# EAGLE board uRinks_v4.0 (EAGLE 9.3.1)
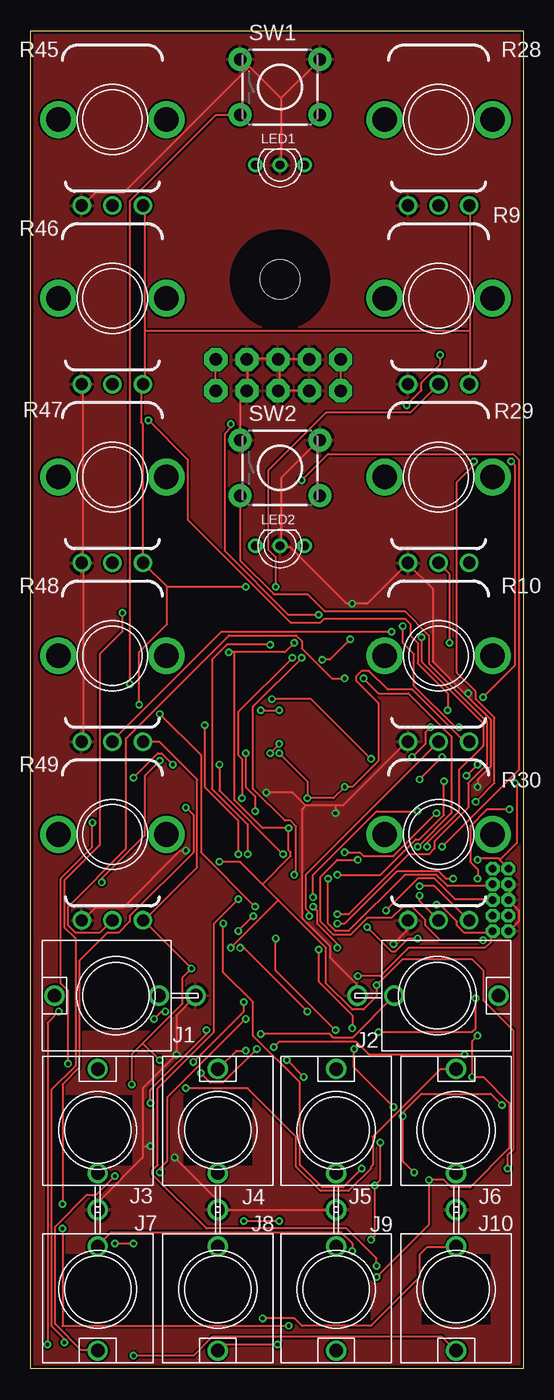
[diagram p5: board, top side]
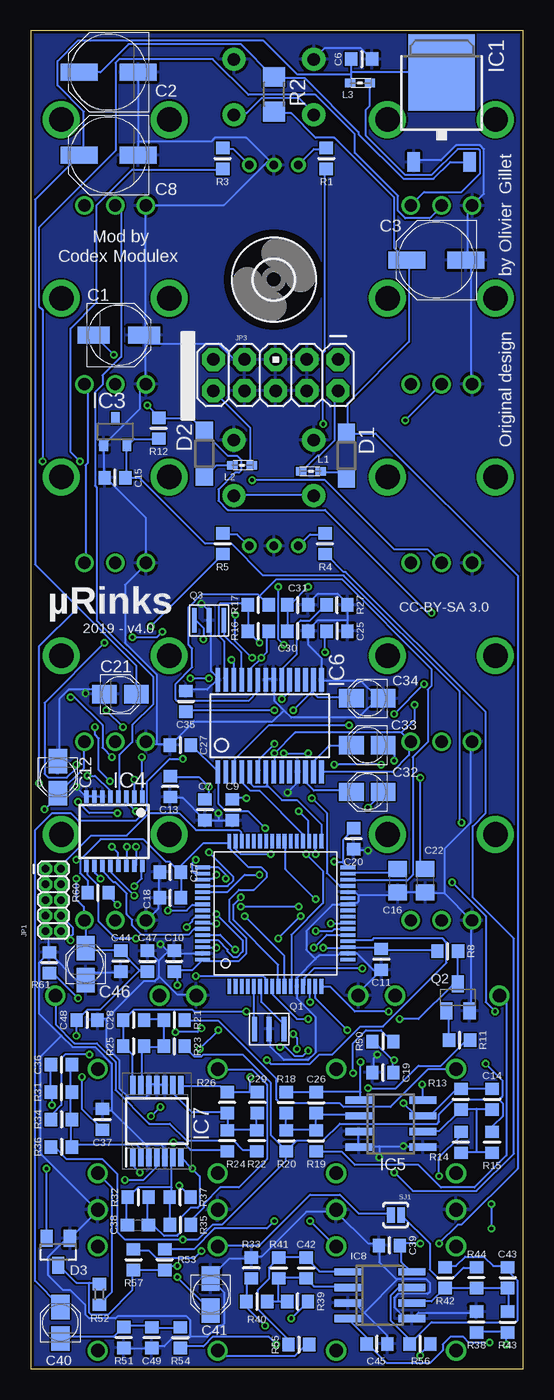
[diagram p6: board, bottom side, seen from below]

Size 40.14 x 109 mm. Coordinates in mm from the lower left corner, seen from the top.
Outline: 40.14,0 0,0 0,109 40.14,109 40.14,0
Copper layers (1*16): Top 0.035mm / dielectric 1.5mm / Bottom 0.035mm
Design rules "dirt_cheap_dirty_boards.v1.1": minimum track width 6mil, minimum drill 12mil, track to track 6mil, track to pad 6mil, pad to pad 6mil, via to via 6mil, smd to smd 0mil, copper to edge 10mil, drill to drill 10mil, minimum pad ring 10mil, minimum via ring 6mil, stop-mask expansion 2mil, vias tented up to drill 25mil, thermal gap 10mil

## Footprints (pad centres in the part's own frame; a part is rotated, then mirrored left to right if it is on the bottom)
PANASONIC_C = smd 2.6 x 1.4: + 2.05,0; - -2.05,0
PANASONIC_D = smd 3 x 1.4: + 2.4,0; - -2.4,0
PARTS_AMAN_RESISTOR_0603 = smd 1 x 1.1: 1 -0.85,0; 2 0.85,0
PANASONIC_A = smd 2 x 1.5: + 1.3,0; - -1.3,0
C0805 = smd 1.3 x 1.5: 1 -0.95,0; 2 0.95,0
C0603 = smd 1.1 x 1: 1 -0.85,0; 2 0.85,0
SOD123 = smd 1.4 x 1.4: A 1.9,0; C -1.9,0
SOT23 = smd 1 x 1.4: 1 -0.95,-1.1; 2 0.95,-1.1; 3 0,1.1
3,2 = hole 3.2: 0,0
TO252 = smd 1 x 1.6: 1 -2.28,-4.8; 2 2.28,-4.8 | smd 5.4 x 6.2: 3 0,2.5
TQFP-10X10-64 = smd 1.2 x 0.3: 1 -5.936,3.75; 2 -5.936,3.25; 3 -5.936,2.75; 4 -5.936,2.25; 5 -5.936,1.75; 6 -5.936,1.25; 7 -5.936,0.75; 8 -5.936,0.25; 9 -5.936,-0.25; 10 -5.936,-0.75; 11 -5.936,-1.25; 12 -5.936,-1.75; 13 -5.936,-2.25; 14 -5.936,-2.75; 15 -5.936,-3.25; 16 -5.936,-3.75; 33 5.886,-3.75; 34 5.886,-3.25; 35 5.886,-2.75; 36 5.886,-2.25; 37 5.886,-1.75; 38 5.886,-1.25; 39 5.886,-0.75; 40 5.886,-0.25; 41 5.886,0.25; 42 5.886,0.75; 43 5.886,1.25; 44 5.886,1.75; 45 5.886,2.25; 46 5.886,2.75; 47 5.886,3.25; 48 5.886,3.75 | smd 0.3 x 1.2: 17 -3.75,-5.911; 18 -3.25,-5.911; 19 -2.75,-5.911; 20 -2.25,-5.911; 21 -1.75,-5.911; 22 -1.25,-5.911; 23 -0.75,-5.911; 24 -0.25,-5.911; 25 0.25,-5.911; 26 0.75,-5.911; 27 1.25,-5.911; 28 1.75,-5.911; 29 2.25,-5.911; 30 2.75,-5.911; 31 3.25,-5.911; 32 3.75,-5.911; 49 3.75,5.936; 50 3.25,5.936; 51 2.75,5.936; 52 2.25,5.936; 53 1.75,5.936; 54 1.25,5.936; 55 0.75,5.936; 56 0.25,5.936; 57 -0.25,5.936; 58 -0.75,5.936; 59 -1.25,5.936; 60 -1.75,5.936; 61 -2.25,5.936; 62 -2.75,5.936; 63 -3.25,5.936; 64 -3.75,5.936
DBZ_R-PDSO-G3 = smd 0.7 x 1: 1 -0.95,-1.1; 2 0.95,-1.1; 3 0,1.1
TSSOP16 = smd 0.35 x 1: 1 -1.95,-2.825; 2 -1.3,-2.825; 3 -0.65,-2.825; 4 0,-2.825; 5 0.65,-2.825; 6 1.3,-2.825; 7 1.95,-2.825; 8 2.6,-2.825; 9 2.6,2.825; 10 1.95,2.825; 11 1.3,2.825; 12 0.65,2.825; 13 0,2.825; 14 -0.65,2.825; 15 -1.3,2.825; 16 -1.95,2.825
SO08 = smd 0.6 x 2.2: 1 -1.905,-2.6; 2 -0.635,-2.6; 3 0.635,-2.6; 4 1.905,-2.6; 5 1.905,2.6; 6 0.635,2.6; 7 -0.635,2.6; 8 -1.905,2.6
SSOP28 = smd 0.381 x 1.905: 1 -4.55,-3.752; 2 -3.9,-3.752; 3 -3.25,-3.752; 4 -2.6,-3.752; 5 -1.95,-3.752; 6 -1.3,-3.752; 7 -0.65,-3.752; 8 0,-3.752; 9 0.65,-3.752; 10 1.3,-3.752; 11 1.95,-3.752; 12 2.6,-3.752; 13 3.25,-3.752; 14 3.9,-3.752; 15 3.9,3.752; 16 3.25,3.752; 17 2.6,3.752; 18 1.95,3.752; 19 1.3,3.752; 20 0.65,3.752; 21 0,3.752; 22 -0.65,3.752; 23 -1.3,3.752; 24 -1.95,3.752; 25 -2.6,3.752; 26 -3.25,3.752; 27 -3.9,3.752; 28 -4.55,3.752
SOP65P640X120-14N = smd 1.475 x 0.45: 1 -2.938,1.95; 2 -2.938,1.3; 3 -2.938,0.65; 4 -2.938,0; 5 -2.938,-0.65; 6 -2.938,-1.3; 7 -2.938,-1.95; 8 2.938,-1.95; 9 2.938,-1.3; 10 2.938,-0.65; 11 2.938,0; 12 2.938,0.65; 13 2.938,1.3; 14 2.938,1.95
WQP-PJ301M-12_JACK = drill 1.1: P$1 0,5; P$2 0,-3.5; P$3 0,-6.5
2X5-1.27 = drill 0.61 pad 1.067 octagon: 1 -1.27,3.81; 2 0,3.81; 3 -1.27,2.54; 4 0,2.54; 5 -1.27,1.27; 6 0,1.27; 7 -1.27,0; 8 0,0; 9 -1.27,-1.27; 10 0,-1.27
AVR_ICSP = drill 1.016 pad 1.88 octagon: 1 -1.27,5.08; 2 1.27,5.08; 3 -1.27,2.54; 4 1.27,2.54; 5 -1.27,0; 6 1.27,0; 7 -1.27,-2.54; 8 1.27,-2.54; 9 -1.27,-5.08; 10 1.27,-5.08
0603 = smd 0.85 x 0.7: 1 -0.9,0; 2 0.7,0
LED-BICOLOR-THROUGHHOLE = drill 0.7: 1 -2,0; 2 0,0; 3 2,0
INSTRUO_CRYSTAL_SMALLER = smd 0.4 x 2: GND 0,0; X1 -1.2,0; X2 1.2,0
SOT23-BEC = smd 1 x 1.4: B -0.95,-1.1; C 0,1.1; E 0.95,-1.1
R1206 = smd 1.6 x 1.803: 1 -1.422,0; 2 1.422,0
INSTRUO_Q-POT2 = drill 1 pad 1.5: P$1 -2.5,-7; P$2 0,-7; P$3 2.5,-7 | drill 2 pad 2.5: P$4 -4.4,0; P$5 4.4,0
R0603 = smd 1 x 1.1: 1 -0.85,0; 2 0.85,0
SJ_2S-NOTRACE = smd 0.635 x 1.27: 1 -0.45,0; 2 0.4,0
TACTILE-PTH = drill 1.016 pad 1.88: 1 -3.251,2.261; 2 3.251,2.261; 3 -3.251,-2.261; 4 3.251,-2.261

## Placement (x,y rotation side)
C1  22u  [PANASONIC_C]  32.95,84.21 0 bottom
C2  47u  [PANASONIC_D]  33.79,105.61 180 bottom
C3  47u  [PANASONIC_D]  7.08,90.31 180 bottom
C6  100n  [PARTS_AMAN_RESISTOR_0603]  13.16,106.68 0 bottom
C7  1u  [PARTS_AMAN_RESISTOR_0603]  25.94,45.53 270 bottom
C8  47u  [PANASONIC_D]  33.79,98.86 180 bottom
C9  100n  [PARTS_AMAN_RESISTOR_0603]  23.7,45.53 270 bottom
C10  100n  [PARTS_AMAN_RESISTOR_0603]  28.44,33.2 90 bottom
C11  100n  [PARTS_AMAN_RESISTOR_0603]  11.57,33.35 270 bottom
C12  10u  [PANASONIC_A]  37.93,48.2 270 bottom
C13  100n  [PARTS_AMAN_RESISTOR_0603]  28.77,47.43 270 bottom
C14  2.2n  [PARTS_AMAN_RESISTOR_0603]  2.54,21.96 90 bottom
C15  100n  [PARTS_AMAN_RESISTOR_0603]  33.26,72.59 180 bottom
C16  2.2u  [C0805]  10.23,39.77 270 bottom
C17  100n  [PARTS_AMAN_RESISTOR_0603]  28.76,40.46 180 bottom
C18  1u  [PARTS_AMAN_RESISTOR_0603]  28.76,38.36 180 bottom
C19  100n  [PARTS_AMAN_RESISTOR_0603]  11.43,24.13 180 bottom
C20  100n  [PARTS_AMAN_RESISTOR_0603]  13.83,43.18 270 bottom
C21  10u  [PANASONIC_A]  32.84,54.95 0 bottom
C22  2.2u  [C0805]  7.99,39.77 270 bottom
C25  100n  [PARTS_AMAN_RESISTOR_0603]  15.17,60.09 0 bottom
C26  10n  [PARTS_AMAN_RESISTOR_0603]  16.87,21.68 90 bottom
C27  100n  [PARTS_AMAN_RESISTOR_0603]  27.94,50.8 180 bottom
C28  10n  [PARTS_AMAN_RESISTOR_0603]  31.75,28.41 0 bottom
C29  2.2n  [PARTS_AMAN_RESISTOR_0603]  21.68,21.69 270 bottom
C30  1u  [PARTS_AMAN_RESISTOR_0603]  18.38,60.09 0 bottom
C31  100n  [PARTS_AMAN_RESISTOR_0603]  18.38,62.23 0 bottom
C32  10u  [PANASONIC_A]  12.7,46.99 180 bottom
C33  10u  [PANASONIC_A]  12.7,50.8 180 bottom
C34  10u  [PANASONIC_A]  12.7,54.61 180 bottom
C35  100n  [PARTS_AMAN_RESISTOR_0603]  27.49,54.37 90 bottom
C36  10n  [PARTS_AMAN_RESISTOR_0603]  37.63,24.77 180 bottom
C37  100n  [PARTS_AMAN_RESISTOR_0603]  34.29,20.32 90 bottom
C38  10n  [C0603]  31.39,11.7 0 bottom
C39  100n  [PARTS_AMAN_RESISTOR_0603]  10.9,10.06 180 bottom
C40  10u  [PANASONIC_A]  37.71,3.75 90 bottom
C41  10u  [PANASONIC_A]  25.48,6.06 270 bottom
C42  18p  [PARTS_AMAN_RESISTOR_0603]  17.68,8.22 90 bottom
C43  18p  [PARTS_AMAN_RESISTOR_0603]  1.27,7.42 90 bottom
C44  100n  [PARTS_AMAN_RESISTOR_0603]  32.8,33.2 270 bottom
C45  100n  [PARTS_AMAN_RESISTOR_0603]  11.91,2.03 180 bottom
C46  10u  [PANASONIC_A]  35.66,32.95 90 bottom
C47  100n  [PARTS_AMAN_RESISTOR_0603]  30.62,33.2 90 bottom
C48  100n  [PARTS_AMAN_RESISTOR_0603]  35.54,28.41 0 bottom
C49  220p  [PARTS_AMAN_RESISTOR_0603]  30.28,2.54 270 bottom
D1  1N5819HW  [SOD123]  14.41,74.38 270 bottom
D2  1N5819HW  [SOD123]  25.99,74.54 90 bottom
D3  BAT54S  [SOT23]  37.89,9.53 180 bottom
H1  MOUNT-HOLE3.2  [3,2]  20.32,88.73 0 bottom
IC1  LM1117-3.3  [TO252]  6.64,103.1 0 bottom
IC2  STM32F405RGT6  [TQFP-10X10-64]  20.2,37.08 90 bottom
IC3  LM4040B10  [DBZ_R-PDSO-G3]  33.24,76.34 0 bottom
IC4  4051PW  [TSSOP16]  32.99,43.78 180 bottom
IC5  MCP6002  [SO08]  10.79,19.97 270 bottom
IC6  WM8731  [SSOP28]  20.34,52.37 0 bottom
IC7  MCP6004-I_ST  [SOP65P640X120-14N]  29.85,20.17 90 bottom
IC8  TL072  [SO08]  11.69,6 270 bottom
J1  WQP-PJ301M-12_JACK  [WQP-PJ301M-12_JACK]  6.94,30.4 90 top
J2  WQP-PJ301M-12_JACK  [WQP-PJ301M-12_JACK]  33.14,30.4 270 top
J3  WQP-PJ301M-12_JACK  [WQP-PJ301M-12_JACK]  5.47,19.43 0 top
J4  WQP-PJ301M-12_JACK  [WQP-PJ301M-12_JACK]  15.25,19.43 0 top
J5  WQP-PJ301M-12_JACK  [WQP-PJ301M-12_JACK]  24.9,19.43 0 top
J6  WQP-PJ301M-12_JACK  [WQP-PJ301M-12_JACK]  34.68,19.43 0 top
J7  WQP-PJ301M-12_JACK  [WQP-PJ301M-12_JACK]  5.47,6.48 180 top
J8  WQP-PJ301M-12_JACK  [WQP-PJ301M-12_JACK]  15.25,6.48 180 top
J9  WQP-PJ301M-12_JACK  [WQP-PJ301M-12_JACK]  24.9,6.48 180 top
J10  WQP-PJ301M-12_JACK  [WQP-PJ301M-12_JACK]  34.68,6.48 180 top
JP1  M05X2MINIJTAG  [2X5-1.27]  37.66,36.92 0 bottom
JP3  M05X2PTH  [AVR_ICSP]  20.17,80.94 270 bottom
L1  [0603]  17.39,73.11 180 bottom
L2  [0603]  22.81,73.61 0 bottom
L3  [0603]  13.19,104.74 0 bottom
LED1  WP115VEGW  [LED-BICOLOR-THROUGHHOLE]  20.32,98.06 180 top
LED2  WP115VEGW  [LED-BICOLOR-THROUGHHOLE]  20.32,67.04 180 top
Q1  8MHz  [INSTRUO_CRYSTAL_SMALLER]  20.7,27.67 180 bottom
Q2  MMBT3904  [SOT23-BEC]  5.32,30.26 0 bottom
Q3  12.288MHz  [INSTRUO_CRYSTAL_SMALLER]  25.6,60.96 180 bottom
R1  180  [PARTS_AMAN_RESISTOR_0603]  16.04,98.59 90 bottom
R2  4.7  [R1206]  20.3,103.82 270 bottom
R3  180  [PARTS_AMAN_RESISTOR_0603]  24.5,98.59 90 bottom
R4  180  [PARTS_AMAN_RESISTOR_0603]  16.14,67.21 90 bottom
R5  180  [PARTS_AMAN_RESISTOR_0603]  24.5,67.21 90 bottom
R8  10k  [PARTS_AMAN_RESISTOR_0603]  6.15,34.01 180 bottom
R9  10kB  [INSTRUO_Q-POT2]  33.25,87.2 0 top
R10  10kB  [INSTRUO_Q-POT2]  33.25,58.09 0 top
R11  100k  [PARTS_AMAN_RESISTOR_0603]  5.18,26.77 180 bottom
R12  2.2k  [PARTS_AMAN_RESISTOR_0603]  29.71,76.62 90 bottom
R13  47k  [PARTS_AMAN_RESISTOR_0603]  5.08,21.96 90 bottom
R14  100k  [PARTS_AMAN_RESISTOR_0603]  5.08,18.45 270 bottom
R15  180k  [PARTS_AMAN_RESISTOR_0603]  2.54,18.45 270 bottom
R16  2.2k  [PARTS_AMAN_RESISTOR_0603]  21.59,60.09 180 bottom
R17  2.2k  [PARTS_AMAN_RESISTOR_0603]  21.59,62.23 180 bottom
R18  20k  [PARTS_AMAN_RESISTOR_0603]  19.32,21.69 90 bottom
R19  100k  [PARTS_AMAN_RESISTOR_0603]  16.88,18.57 90 bottom
R20  120k  [PARTS_AMAN_RESISTOR_0603]  19.3,18.57 90 bottom
R21  100k  [PARTS_AMAN_RESISTOR_0603]  28.44,28.41 0 bottom
R22  100k  [PARTS_AMAN_RESISTOR_0603]  21.71,18.57 270 bottom
R23  120k  [PARTS_AMAN_RESISTOR_0603]  28.44,26.27 0 bottom
R24  120k  [PARTS_AMAN_RESISTOR_0603]  24.13,18.57 270 bottom
R25  20k  [PARTS_AMAN_RESISTOR_0603]  31.75,26.27 0 bottom
R26  20k  [PARTS_AMAN_RESISTOR_0603]  24.13,21.69 270 bottom
R27  36k  [PARTS_AMAN_RESISTOR_0603]  15.17,62.23 180 bottom
R28  10kB  [INSTRUO_Q-POT2]  33.25,101.76 0 top
R29  10kB  [INSTRUO_Q-POT2]  33.25,72.64 0 top
R30  10kB  [INSTRUO_Q-POT2]  33.25,43.53 0 top
R31  20k  [PARTS_AMAN_RESISTOR_0603]  37.63,22.54 180 bottom
R32  20k  [PARTS_AMAN_RESISTOR_0603]  31.38,13.97 0 bottom
R33  47k  [PARTS_AMAN_RESISTOR_0603]  22.16,8.22 270 bottom
R34  100k  [PARTS_AMAN_RESISTOR_0603]  37.63,20.31 0 bottom
R35  100k  [PARTS_AMAN_RESISTOR_0603]  27.94,11.73 180 bottom
R36  120k  [PARTS_AMAN_RESISTOR_0603]  37.63,18.08 0 bottom
R37  120k  [PARTS_AMAN_RESISTOR_0603]  27.96,13.98 180 bottom
R38  47k  [PARTS_AMAN_RESISTOR_0603]  3.81,3.81 270 bottom
R39  47k  [PARTS_AMAN_RESISTOR_0603]  18.39,5.48 180 bottom
R40  6.8k  [PARTS_AMAN_RESISTOR_0603]  21.71,5.48 0 bottom
R41  47k  [PARTS_AMAN_RESISTOR_0603]  19.92,8.22 90 bottom
R42  47k  [PARTS_AMAN_RESISTOR_0603]  6.35,7.42 90 bottom
R43  6.8k  [PARTS_AMAN_RESISTOR_0603]  1.27,3.81 90 bottom
R44  47k  [PARTS_AMAN_RESISTOR_0603]  3.81,7.42 270 bottom
R45  10kB  [INSTRUO_Q-POT2]  6.66,101.76 0 top
R46  10kB  [INSTRUO_Q-POT2]  6.66,87.2 0 top
R47  10kB  [INSTRUO_Q-POT2]  6.66,72.64 0 top
R48  10kB  [INSTRUO_Q-POT2]  6.66,58.09 0 top
R49  10kB  [INSTRUO_Q-POT2]  6.66,43.53 0 top
R50  3.3M  [PARTS_AMAN_RESISTOR_0603]  11.43,26.67 0 bottom
R51  6.8k  [PARTS_AMAN_RESISTOR_0603]  32.55,2.55 90 bottom
R52  100k  [R0603]  34.53,6.06 270 bottom
R53  1M  [PARTS_AMAN_RESISTOR_0603]  29.21,8.89 90 bottom
R54  36k  [PARTS_AMAN_RESISTOR_0603]  27.94,2.54 90 bottom
R55  1k  [PARTS_AMAN_RESISTOR_0603]  18.28,1.97 0 bottom
R56  1k  [PARTS_AMAN_RESISTOR_0603]  8.41,2.03 0 bottom
R57  470k  [PARTS_AMAN_RESISTOR_0603]  31.75,8.89 90 bottom
R60  10k  [PARTS_AMAN_RESISTOR_0603]  34.64,38.78 180 bottom
R61  10k  [PARTS_AMAN_RESISTOR_0603]  38.62,33.07 270 bottom
SJ1  SOLDERJUMPERNC2  [SJ_2S-NOTRACE]  10.39,12.54 180 bottom
SW1  [TACTILE-PTH]  20.32,104.41 0 top
SW2  [TACTILE-PTH]  20.32,73.39 0 top

## Tracks (layer width: path | path; a pad name or v marks a point on that pad's centre or on a via)
+3V3  (via drill 0.3)
  Top 0.152: 38.25,41.45 38.1,41.6 36.58,41.6 v36.42,41.45 | 38.25,41.45 38.86,40.84 JP1.1 | 16.61,58.37 20.73,58.37 v21.49,59.13 | 16.61,58.37 v16.15,58.37 | v38.86,16.31 38.86,17.37 39.32,17.83 39.32,27.58 36.88,30.02 36.88,32.46 35.97,33.38 30.33,33.38 v28.19,31.24 28.19,30.33 27.13,29.26 26.21,29.26 24.08,31.39 24.08,34.29 20.12,38.25 | v15.39,41.3 17.07,41.3 18.9,39.47 | 20.12,38.25 18.9,39.47 | 18.9,39.47 21.18,41.76 21.18,42.06 21.03,42.22 v21.03,44.04 18.9,44.04 16.61,46.33 16.61,58.37 | v16.31,34.29 20.12,38.1 20.12,38.25 | 38.25,41.45 39.62,42.82 39.62,47.55 v39.47,47.7
  Bottom 0.152: C18.1 27.89,38.41 27.89,40.39 C17.1 | 36.12,41.45 36.12,40.39 35.51,39.78 35.51,38.86 R60.2 | 36.12,41.45 34.44,43.13 30.94,43.13 29.11,41.3 28.8,41.3 28.19,40.69 | 28.19,40.69 28.04,40.54 C17.1 | 28.19,40.69 26.06,42.82 24.08,42.82 IC2.48 23.93,42.82 23.93,42.37 22.4,40.84 21.34,40.84 20.88,40.39 20.88,40.08 21.95,39.01 23.16,39.01 23.93,38.25 23.93,36.42 22.55,35.05 22.55,33.83 23.16,33.22 26.06,33.22 IC2.64 26.21,33.22 26.98,32.46 28.19,32.46 | 28.19,40.69 C17.1 | 36.12,41.45 v36.42,41.45 | v16.15,58.37 16.15,60.05 C25.1 | v21.49,59.13 22.4,60.05 R16.2 22.4,60.2 22.4,62.18 R17.2 22.55,62.33 24.69,62.33 24.84,62.18 24.84,59.74 24.38,59.28 24.38,56.24 IC6.27 | R8.2 7.01,34.14 11.43,34.14 C11.1 11.58,34.29 14.17,34.29 IC2.19 14.33,34.29 v16.31,34.29 | C27.1 26.98,50.75 24.99,48.77 IC6.1 24.84,48.62 24.84,46.02 24.23,45.41 22.4,45.41 v21.03,44.04 | 14.63,41.3 14.63,41.15 14.33,40.84 IC2.32 | 14.63,41.3 14.63,43.13 13.87,43.89 C20.1 | 28.19,32.46 28.35,32.46 C10.1 28.19,32.46 | v38.86,16.31 38.86,10.67 D3.2 | 28.19,32.46 v28.19,31.24 | v15.39,41.3 14.63,41.3 | 14.02,105.61 14.02,106.68 C6.1 | 14.02,105.61 14.02,105.46 | 14.02,105.46 14.02,104.85 L3.1 | 14.02,105.61 6.71,105.61 IC1.3 | 36.27,62.03 39.78,65.53 39.78,95.25 36.27,98.75 C8.+ 36.12,98.91 35.81,99.21 35.81,102.41 37.95,104.55 37.95,106.53 36.27,108.2 21.18,108.2 18.44,105.46 14.02,105.46 | 36.27,62.03 31.55,57.3 31.55,55.02 C21.+ | v39.47,47.7 39.47,58.83 36.27,62.03
+3V3_A  (via drill 0.3)
  Top 0.152: 35.81,84.58 35.81,80.31 R9.P$3 | 35.81,84.58 35.81,94.64 R28.P$3 | 11.12,63.7 v17.53,63.7 | 11.12,63.7 9.3,65.53 R47.P$3 9.14,65.68 9.14,76.96 8.99,77.11 8.99,80.01 9.14,80.16 R46.P$3 9.3,80.31 9.3,84.58 | 9.3,84.58 9.3,94.64 R45.P$3 | 9.3,84.58 35.81,84.58 | v31.7,39.32 32.92,39.32 35.66,36.58 R30.P$3 | v36.42,27.13 35.97,26.67 v35.97,23.77 36.88,23.77 39.01,21.64 39.01,17.98 35.81,14.78 34.29,14.78 33.68,15.39 v32.46,15.39 32.46,11.73 v28.19,7.47 | R10.P$3 35.66,51.21 35.2,51.21 31.09,55.32 29.11,55.32 27.58,56.84 26.98,56.84 26.52,56.39 26.52,56.08 28.35,54.25 28.35,49.53 26.21,47.4 v25.6,47.4 24.69,46.48 v22.55,46.48 22.55,47.85 v20.27,50.14 | v8.23,23.16 8.23,25.6 9.14,26.52 | 9.14,26.52 12.34,29.72 12.34,31.85 v13.11,32.61 9.3,36.42 R49.P$3 9.3,36.58 13.56,40.84 13.56,48.01 10.52,51.05 9.3,51.05 R48.P$3 | 9.14,26.52 v10.52,25.15 | v36.42,39.93 36.42,40.69 35.81,41.3 35.81,44.2 37.19,45.57 v39.01,45.57 | 11.12,63.7 11.12,60.66 8.84,58.37 v8.84,54.1
  Bottom 0.152: R29.P$3 35.66,65.68 35.66,73.61 35.51,73.76 35.51,80.01 35.66,80.16 R9.P$3 | C30.1 19.2,60.2 19.2,62.18 C31.1 19.2,62.33 18.9,62.33 v17.53,63.7 | L3.2 12.5,104.7 12.5,102.87 12.8,102.56 12.8,100.43 9.6,97.23 7.47,97.23 5.33,99.36 3.66,99.36 3.5,99.21 3.5,97.38 5.03,95.86 8.08,95.86 9.14,94.79 R45.P$3 | 31.24,32.46 30.63,32.46 C47.1 | 31.24,32.46 32.77,33.98 C44.1 32.92,34.14 35.51,34.14 C46.+ 35.66,34.29 35.66,36.42 R30.P$3 35.81,36.58 35.81,37.64 36.42,38.25 v36.42,39.93 | v31.7,39.32 31.09,39.93 31.09,40.84 IC4.16 | v35.97,23.77 35.97,21.18 34.29,19.51 C37.1 | v36.42,27.13 36.42,28.35 C48.1 36.27,28.5 35.51,29.26 34.44,29.26 31.24,32.46 | v32.46,15.39 30.94,15.39 29.87,16.46 29.87,17.22 IC7.4 | v28.19,7.47 25.6,4.88 C41.+ | v22.55,46.48 23.62,46.48 C9.1 | C7.1 25.91,46.48 25.6,46.79 v25.6,47.4 26.36,48.16 28.65,48.16 C13.1 | R10.P$3 35.81,51.05 35.81,48.92 37.8,46.94 C12.+ 37.8,46.79 v39.01,45.57 | IC6.14 16.31,48.62 10.67,48.62 9.3,49.99 9.3,51.05 R48.P$3 9.3,51.21 9.91,51.82 | 9.91,51.82 18.59,51.82 v20.27,50.14 20.27,48.77 IC6.8 | 10.67,25.15 10.67,24.23 C19.1 | 10.67,25.15 12.19,26.67 R50.1 | v13.11,32.61 17.07,32.61 17.83,31.85 17.83,31.24 IC2.13 | v8.23,23.16 8.23,21.95 IC5.8 | v10.52,25.15 10.67,25.15 | v8.84,54.1 8.84,52.88 9.91,51.82
AREF_-10  (via drill 0.3)
  Top 0.152: v28.5,18.44 28.5,15.39 v28.04,14.94 28.04,10.82 v27.74,10.52 | v5.03,44.5 5.03,42.52 2.44,39.93 2.44,31.39 3.05,30.79 v3.05,24.84
  Bottom 0.152: v28.5,18.44 27.74,18.44 27.13,17.83 24.23,17.83 R24.2 | v28.04,14.94 27.13,14.02 R37.1 | R12.1 29.72,75.74 31.7,75.74 32.16,75.29 IC3.2 32.31,75.13 32.31,72.69 C15.1 32.31,72.54 31.24,72.54 25.91,67.21 23.77,67.21 21.18,64.62 14.63,64.62 5.18,55.17 5.18,44.65 v5.03,44.5 | R20.1 19.36,17.83 20.57,19.05 20.57,23.32 22.86,25.6 26.06,25.6 26.21,25.45 26.82,25.45 27.58,26.21 R23.2 | 1.98,21.95 1.68,21.64 1.68,20.57 2.44,19.81 2.44,19.36 R15.1 | 1.98,21.95 5.64,21.95 6.86,20.73 6.86,20.12 7.01,19.96 14.94,19.96 16.31,18.59 18.44,18.59 19.2,17.83 R20.1 | R36.1 38.41,17.98 38.1,17.98 37.19,17.07 34.29,17.07 33.07,15.85 33.07,11.12 32.46,10.52 v27.74,10.52 26.52,10.52 25.3,11.73 24.54,11.73 19.36,16.92 19.36,17.68 R20.1 | v3.05,24.84 1.68,23.47 1.68,22.25 1.98,21.95
AUX_OUT
  Bottom 0.152: IC6.13 17.07,48.77 17.07,49.53 15.85,50.75 14.02,50.75 C33.+
BOOT_FLASH  (via drill 0.3)
  Top 0.152: v36.27,30.18 36.27,27.74 35.97,27.43 v28.35,27.43 | v26.21,27.74 26.21,28.8 23.47,31.55 v23.47,34.14
  Bottom 0.152: v36.27,30.18 38.25,32.16 38.56,32.16 R61.2 | v28.35,27.43 26.52,27.43 v26.21,27.74 | v23.47,34.14 24.69,35.36 26.06,35.36 IC2.60
BRIGHTNESS_ATT  (via drill 0.3)
  Top 0.152: v33.53,49.84 v31.7,48.01 | v36.88,54.71 39.47,57.3 39.47,73.61 v39.17,73.91
  Bottom 0.152: v31.7,48.01 31.7,46.63 IC4.2 | v33.53,49.84 34.29,50.6 34.29,52.43 36.58,54.71 v36.88,54.71 | v39.17,73.91 39.17,86.26 39.47,86.56 39.47,92.96 33.22,99.21 33.22,106.38 32.92,106.68 25.3,106.68 22.4,103.78 16.92,103.78 13.72,100.58 13.72,99.06 10.21,95.56 10.21,94.34 9.6,93.73 7.62,93.73 6.71,94.64 R45.P$2
BRIGHTNESS_CV  (via drill 0.3)
  Top 0.152: v17.37,29.87 17.37,29.11 v13.26,24.99
  Bottom 0.152: R18.2 19.2,22.55 16.92,22.55 C26.2 16.76,22.55 13.26,22.55 | v17.37,29.87 17.37,31.09 IC2.14 | 13.26,22.55 13.26,21.95 IC5.1 | 13.26,22.55 v13.26,24.99
BRIGHTNESS_POT
  Bottom 0.152: IC4.4 32.92,46.63 32.92,49.99 31.85,51.05 31.85,52.43 30.18,54.1 30.18,56.39 34.75,60.96 34.75,71.78 34.9,71.93 34.9,79.55 34.29,80.16 34.29,80.92 32.77,82.45 32.77,94.18 33.22,94.64 R28.P$2
CV_NORMALIZATION  (via drill 0.3)
  Top 0.152: v26.21,9.6 26.21,10.21 25.3,11.12 6.55,11.12 5.49,10.06 J7.P$2
  Bottom 0.152: v26.21,9.6 26.82,8.99 29.87,8.99 30.48,9.6 31.7,9.6 R57.2
DAMP_ATT  (via drill 0.3)
  Top 0.152: v33.53,42.52 39.78,48.77 39.78,74.07 39.32,74.52 24.23,74.52 v22.1,72.39
  Bottom 0.152: v33.53,42.52 33.07,42.06 33.07,41 IC4.13 | v22.1,72.39 16.15,72.39 10.52,66.75 7.77,66.75 6.71,65.68 R47.P$2
DAMP_CV  (via drill 0.3)
  Top 0.152: v17.07,34.29 17.37,34.29 v22.55,29.11
  Bottom 0.152: v17.07,34.29 16,35.36 14.33,35.36 IC2.21 | v22.55,29.11 26.82,29.11 26.98,29.26 31.7,29.26 32.46,28.5 C28.1 32.61,28.35 32.61,26.36 R25.1 32.46,26.21 31.85,25.6 31.85,23.16 IC7.14
DAMP_POT  (via drill 0.3)
  Top 0.152: v36.42,49.23 v35.51,48.31 | v34.14,59.13 34.14,64.77 33.38,65.53 R29.P$2
  Bottom 0.152: v35.51,48.31 34.9,48.31 33.68,47.09 33.68,46.63 IC4.5 | v36.42,49.23 36.42,48.92 37.19,48.16 38.71,48.16 39.01,48.46 39.01,54.25 v34.14,59.13
FM_CV  (via drill 0.3)
  Top 0.152: v22.25,23.77 v20.88,25.15
  Bottom 0.152: 22.25,22.55 24.08,22.55 R26.1 24.23,22.55 24.69,23.01 27.89,23.01 IC7.8 | 22.25,22.55 21.79,22.55 C29.1 | v20.88,25.15 20.57,24.84 17.37,24.84 16.61,25.6 15.54,25.6 13.26,27.89 11.43,27.89 6.25,33.07 6.25,34.75 6.55,35.05 12.19,35.05 12.34,34.9 14.17,34.9 IC2.20 | 22.25,22.55 v22.25,23.77
FREQUENCY_ATT  (via drill 0.3)
  Top 0.152: v31.09,49.84 32.16,50.9 32.16,51.82 v32.61,52.27 | v33.98,53.65 33.98,55.02 31.55,57.45 31.55,59.13 30.94,59.74 30.94,60.66 30.48,61.11 23.93,61.11 23.62,60.81 21.18,60.81 12.8,69.19 12.8,74.07 v9.6,77.27
  Bottom 0.152: v31.09,49.84 31.09,46.63 IC4.1 | v33.98,53.65 v32.61,52.27 | v9.6,77.27 6.71,80.16 R46.P$2
FREQUENCY_POT  (via drill 0.3)
  Top 0.152: v17.68,41.91 17.68,44.35 14.78,47.24 14.78,57.76 16,58.98 v19.51,58.98 | v19.96,63.7 19.96,66.14 19.36,66.75 19.36,73.15 24.08,77.88 30.94,77.88 33.22,80.16 R9.P$2
  Bottom 0.152: v17.68,41.91 16.31,40.54 16.31,37.95 18.9,35.36 18.9,31.24 IC2.11 | v19.51,58.98 19.96,59.44 v19.96,63.7
GEOMETRY_ATT  (via drill 0.3)
  Top 0.152: v32.31,42.52 32.31,42.82 34.9,45.41 34.9,48.77 36.88,50.75 36.88,52.58 31.85,57.61 v31.85,59.59 | v29.41,60.05 15.54,60.05 6.71,51.21 R48.P$2
  Bottom 0.152: v32.31,42.52 32.31,41 IC4.14 | v31.85,59.59 29.87,59.59 v29.41,60.05
GEOMETRY_CV  (via drill 0.3)
  Top 0.152: v18.14,36.88 v16.92,35.66 | v19.96,35.05 19.96,32.46 v24.84,27.58 | v26.36,26.06 26.36,24.54 v29.57,21.34 | v31.24,16 30.33,16.92 v30.33,20.57 30.33,20.88 31.85,22.4 37.49,22.4 v38.41,21.49
  Bottom 0.152: C36.2 38.56,24.69 38.56,22.55 R31.2 38.41,22.4 v38.41,21.49 | v16.92,35.66 15.54,35.66 15.39,35.81 14.33,35.81 IC2.22 | v19.96,35.05 v18.14,36.88 | v26.36,26.06 v24.84,27.58 | v30.33,20.57 v29.57,21.34 | v31.24,16 31.7,16.46 31.7,17.22 IC7.1
GEOMETRY_POT  (via drill 0.3)
  Top 0.152: v22.71,36.88 22.71,37.19 22.4,37.49 22.4,40.23 33.22,51.05 R10.P$2
  Bottom 0.152: v22.71,36.88 19.51,33.68 19.51,31.24 IC2.10
GND  (via drill 0.3)
  Top 0.152: v29.57,34.59 30.63,35.66 30.63,36.42 R30.P$1 | v19.2,46.94 21.34,46.94 22.4,45.87 | 24.84,45.87 25.45,45.87 30.63,51.05 R10.P$1 | 24.84,45.87 22.4,45.87 | 24.84,45.87 v24.84,45.26 | 22.4,45.87 22.1,45.57 22.1,36.73 24.38,34.44 24.38,33.53 26.52,31.39 26.52,30.48 J2.P$3 | SW2.2 23.47,75.59 20.42,72.54 20.42,67.06 LED2.2 20.42,66.9 21.18,66.9 25.76,62.33 v26.21,62.33 27.43,62.33 30.63,65.53 R29.P$1 30.79,65.53 32.77,63.55 32.77,57.61 35.51,54.86 | v36.42,47.4 36.42,48.01 37.49,49.07 37.49,52.88 35.51,54.86 | 35.51,54.86 v35.66,55.02 | 20.42,103.48 20.42,98.15 LED1.2 | 20.42,103.48 23.47,106.53 SW1.2 | 20.42,103.48 17.83,106.07 | 17.83,106.07 17.37,106.53 17.07,106.53 SW1.1 | SW2.1 17.07,79.1 17.53,79.55 JP3.4 17.68,79.7 17.68,82.14 JP3.3 17.68,82.3 20.12,82.3 JP3.5 | 20.27,79.7 20.27,82.14 JP3.5 | 20.27,79.7 22.71,79.7 JP3.8 | 20.27,79.7 JP3.6 | JP3.7 22.71,82.3 20.27,82.3 JP3.5 | JP1.3 39.01,39.32 39.01,38.25 JP1.5 39.01,38.1 39.78,37.34 39.78,36.42 39.01,35.66 JP1.9 | J6.P$3 34.75,12.95 J10.P$3 | 24.84,12.95 J9.P$3 | J4.P$3 15.24,12.95 J8.P$3 | 24.84,12.95 15.39,12.95 J4.P$3 | 24.84,12.95 J5.P$3 | J7.P$3 5.49,12.95 J3.P$3 5.49,13.11 5.49,13.56 9.14,17.22 9.14,18.14 | J1.P$3 13.41,30.33 11.89,28.8 v11.89,25.6 9.14,22.86 9.14,18.14 | 9.14,18.14 v9.75,18.14 | R48.P$1 4.27,51.21 4.27,65.53 R47.P$1 4.27,65.68 4.27,80.16 R46.P$1 | v12.65,42.22 12.19,42.22 7.62,37.64 5.33,37.64 4.27,36.58 R49.P$1 | v11.73,17.22 15.24,13.72 15.24,13.11 J4.P$3 | 17.83,106.07 7.62,95.86 5.33,95.86 4.27,94.79 R45.P$1
  Bottom 0.152: C17.2 29.72,40.39 29.72,38.41 C18.2 29.72,38.25 29.72,37.49 30.63,36.58 R30.P$1 | IC7.10 29.26,23.16 29.72,23.16 IC7.11 29.87,23.16 30.48,23.16 IC7.12 30.63,23.01 30.63,22.25 30.79,22.1 32.16,22.1 32.92,22.86 32.92,25.15 33.98,26.21 33.98,28.5 | 33.98,28.5 34.59,28.5 C48.2 | 33.98,28.5 30.94,31.55 30.02,31.55 29.72,31.85 29.72,32 | 29.72,33.22 29.72,32 | 29.72,33.22 30.48,33.98 C47.2 | 28.96,33.98 28.5,33.98 C10.2 | 29.72,33.22 28.96,33.98 | IC2.63 26.21,33.83 28.19,33.83 28.35,33.98 C10.2 | 29.72,32 28.19,30.48 26.67,30.48 J2.P$3 | 28.96,33.98 v29.57,34.59 | 28.96,33.98 C10.2 | IC6.22 20.88,56.24 20.42,56.24 IC6.21 20.27,56.08 20.27,54.41 19.51,53.65 | 14.33,60.96 14.33,62.18 R27.1 14.33,62.33 15.09,63.09 16.76,63.09 17.53,62.33 C31.2 | 14.33,60.96 14.33,60.2 C25.2 | 14.33,60.96 16.76,60.96 17.53,60.2 C30.2 17.53,60.05 17.53,58.98 16.46,57.91 16.46,56.24 IC6.15 16.31,56.08 13.26,56.08 11.89,54.71 11.73,54.71 | 11.73,54.71 11.43,54.71 C34.- 11.73,54.71 | 19.51,53.65 18.9,53.03 13.41,53.03 11.73,54.71 | 24.84,44.65 25.91,44.65 C7.2 26.06,44.81 27.74,46.48 28.65,46.48 C13.2 | 24.84,44.65 23.77,44.65 C9.2 | 29.87,50.9 30.48,50.9 30.63,51.05 R10.P$1 | 29.87,50.9 28.8,50.9 C27.2 28.65,50.9 26.82,52.73 20.42,52.73 19.51,53.65 | v19.2,46.94 18.44,47.7 18.44,48.62 IC6.11 | v24.84,45.26 24.84,44.65 | 35.66,55.32 34.59,55.32 34.29,55.02 C21.- | 35.66,55.32 37.03,55.32 37.8,54.56 37.8,49.53 C12.- | C35.2 27.43,55.32 25.76,55.32 24.99,56.08 IC6.28 24.84,56.24 25.45,56.84 25.45,60.96 Q3.GND 25.6,61.72 v26.21,62.33 | IC4.6 34.29,46.63 34.9,46.63 IC4.7 35.05,46.63 35.51,46.63 IC4.8 35.66,46.63 v36.42,47.4
  Bottom 0.152: v35.66,55.02 35.66,55.32 | 31.39,99.97 31.39,105.46 C2.- | 31.39,99.97 31.39,98.91 C8.- | C6.2 12.34,106.68 13.26,107.59 16.15,107.59 SW1.1 | 31.39,99.97 25.45,99.97 25.15,100.28 22.55,100.28 20.73,98.45 | 20.73,98.45 20.42,98.15 LED1.2 20.73,98.45 | 30.79,83.52 30.79,80.31 R9.P$1 30.79,80.16 31.24,79.7 31.24,78.18 34.14,75.29 IC3.1 34.14,75.13 34.14,72.69 C15.2 33.98,72.54 30.79,69.34 30.79,65.68 R29.P$1 30.79,65.53 32.46,63.86 32.46,59.13 29.87,56.54 29.87,50.9 | 30.79,83.52 30.79,84.12 C1.+ | C1.+ 30.79,84.28 30.79,94.64 R28.P$1 30.63,94.79 24.38,94.79 20.73,98.45 | 30.79,83.52 24.84,83.52 23.62,82.3 22.86,82.3 JP3.7 | 30.79,83.52 C1.+ | 33.53,21.03 34.29,21.03 C37.2 | 30.79,18.29 30.63,18.14 30.63,17.37 IC7.3 | 30.79,18.29 33.53,21.03 | 30.79,18.29 29.57,18.29 29.26,17.98 29.26,17.37 IC7.5 | C44.2 32.92,32.31 34.9,32.31 35.51,31.7 C46.- 35.66,31.7 36.42,31.7 38.56,33.83 R61.1 | R61.1 38.71,33.98 38.71,35.36 38.86,35.51 JP1.9 | 33.53,21.03 33.53,24.84 34.9,26.21 36.73,26.21 37.64,27.13 | 37.64,27.13 39.47,28.96 39.47,33.07 38.71,33.83 R61.1 | J10.P$3 34.75,12.8 36.88,10.67 D3.1 37.03,10.52 37.34,10.52 38.71,9.14 38.71,7.62 37.49,6.4 36.88,6.4 35.66,5.18 35.66,4.42 35.36,4.12 33.22,4.12 33.07,4.27 27.43,4.27 27.13,3.96 27.13,2.59 | R51.1 32.46,1.68 30.33,1.68 C49.2 30.18,1.83 29.26,1.83 28.5,2.59 27.13,2.59 | 27.13,2.59 25.76,2.59 24.84,3.5 24.54,3.5 24.38,3.66 24.38,6.25 25.45,7.32 C41.- 25.45,7.47 23.93,8.99 22.25,8.99 R33.1 22.1,9.14 21.34,9.14 17.68,12.8 15.39,12.8 J4.P$3 | 12.95,4.57 13.72,5.33 14.17,5.33 IC8.3 | 12.95,4.57 11.12,2.74 11.12,2.13 C45.1
  Bottom 0.152: R38.1 3.81,4.57 8.53,4.57 8.99,4.12 IC8.5 9.14,4.12 9.6,4.12 10.52,5.03 10.52,5.79 10.21,6.1 7.77,6.1 7.62,6.25 7.62,7.01 7.92,7.32 10.21,7.32 | J8.P$3 15.24,12.8 12.65,10.21 11.89,10.21 C39.2 11.73,10.06 11.73,8.69 10.36,7.32 10.21,7.32 | 10.21,7.32 12.95,4.57 | 37.64,27.13 39.32,25.45 39.32,17.53 34.75,12.95 J6.P$3 | 11.73,18.14 13.26,18.14 IC5.4 13.41,18.14 13.41,19.2 IC5.3 | 11.73,18.14 v9.75,18.14 8.23,18.14 IC5.5 | 11.89,32.16 13.56,30.48 J1.P$3 | 11.89,32.16 11.58,32.46 C11.2 11.89,32.16 | v11.89,25.6 12.19,25.3 12.19,24.23 C19.2 | 11.89,32.16 13.56,33.83 14.17,33.83 IC2.18 14.33,33.83 14.94,33.83 15.09,33.68 16.61,33.68 16.92,33.38 | 16.92,33.38 18.44,31.85 18.44,31.24 IC2.12 18.44,31.09 18.44,30.18 16.92,28.65 16.92,25.76 17.53,25.15 19.51,25.15 20.57,26.21 20.57,27.58 Q1.GND | IC1.1 8.84,98.45 6.71,98.45 5.49,99.67 3.5,99.67 3.2,99.36 3.2,95.71 4.12,94.79 R45.P$1 4.27,94.64 4.57,94.34 4.57,90.37 C3.- 4.57,90.22 4.27,89.92 4.27,80.31 R46.P$1 | 13.41,38.56 13.41,38.1 13.56,37.95 14.17,37.95 IC2.26 14.33,37.8 15.54,37.8 17.68,35.66 17.68,34.14 16.92,33.38 | 13.41,38.56 13.72,38.86 14.17,38.86 IC2.28 | 13.41,38.56 10.52,38.56 10.36,38.71 C16.2 10.21,38.86 8.08,38.86 C22.2 7.92,38.71 6.4,38.71 | v12.65,42.22 13.72,42.22 C20.2 | Q2.E 4.27,29.26 4.27,36.42 R49.P$1 4.27,36.58 6.4,38.71 | 6.4,38.71 6.4,42.37 4.27,44.5 4.27,51.05 R48.P$1 | 11.73,18.14 v11.73,17.22
  pour Top (isolate 0.012): 0,109.02 40.14,109.02 40.14,0 0,0
  pour Bottom (isolate 0.012): 0,109.02 40.14,109.02 40.14,0 0,0
I2C_SCL  (via drill 0.3)
  Top 0.152: v17.22,46.48 17.22,49.68 16.92,49.99 16.92,53.49 v21.34,57.91
  Bottom 0.152: R16.1 20.88,60.05 20.88,58.37 v21.34,57.91 22.25,57 22.25,56.24 IC6.24 | v17.22,46.48 16,45.26 16,40.39 14.94,39.32 14.33,39.32 IC2.29
I2C_SDA
  Bottom 0.152: 21.49,62.94 21.64,63.09 26.21,63.09 27.28,62.03 27.28,58.98 26.98,58.67 26.98,57.15 28.35,55.78 28.35,54.56 28.19,54.41 22.4,54.41 21.64,55.17 21.64,56.08 IC6.23 | 21.49,62.94 20.88,62.33 R17.1 | 21.49,62.94 20.12,64.31 14.78,64.31 7.47,57 7.47,55.63 7.77,55.32 7.77,51.05 8.99,49.84 8.99,40.23 9.45,39.78 14.17,39.78 IC2.30
I2S_LRCK
  Bottom 0.152: 20.73,47.4 20.88,47.55 20.88,48.62 IC6.7 | 20.73,47.4 19.66,46.33 18.44,46.33 16.46,44.35 IC2.33 | 20.73,47.4 21.95,47.4 22.25,47.7 22.25,48.62 IC6.5
I2S_SCK  (via drill 0.3)
  Top 0.152: v16.92,41.91 16.92,44.65 14.17,47.4 v14.17,52.43
  Bottom 0.152: v16.92,41.91 16.92,42.82 IC2.34 | v14.17,52.43 20.73,52.43 23.47,49.68 23.47,48.77 IC6.3
I2S_SIN  (via drill 0.3)
  Top 0.152: v18.29,45.41 18.29,46.63 17.53,47.4 v17.53,50.14 | v20.27,50.9 v19.51,50.14
  Bottom 0.152: v18.29,45.41 17.53,44.65 17.53,42.98 IC2.35 | v19.51,50.14 v17.53,50.14 | v20.27,50.9 21.49,49.68 21.49,48.77 IC6.6
I2S_SOUT
  Bottom 0.152: IC2.36 17.98,42.98 17.98,43.59 21.49,47.09 22.25,47.09 22.86,47.7 22.86,48.62 IC6.4
IN_1
  Bottom 0.152: R27.2 16.15,62.18 17.37,60.96 18.14,60.96 18.44,60.66 18.44,58.22 19.66,57 19.66,56.24 IC6.20
IN_2  (via drill 0.3)
  Top 0.152: v19.66,54.56 22.86,54.56 v27.74,49.68
  Bottom 0.152: v19.66,54.56 19.05,55.17 19.05,56.08 IC6.19 | v27.74,49.68 28.8,49.68 30.63,47.85 30.63,45.57 31.55,44.65 36.27,44.65 36.88,45.26 38.41,45.26 39.78,43.89 39.78,7.16 37.8,5.18 C40.+
JTCK  (via drill 0.3)
  Top 0.152: v24.23,39.93 24.23,36.27 24.84,35.66 25.91,35.66 30.48,40.23 33.07,40.23 33.98,39.32 37.64,39.32 JP1.4
  Bottom 0.152: v24.23,39.93 24.23,40.23 24.84,40.84 26.06,40.84 IC2.49
JTDI  (via drill 0.3)
  Top 0.152: v26.67,41.45 24.99,41.45 23.62,40.08 23.62,36.42 24.69,35.36 26.06,35.36 27.43,36.73 29.41,36.73 30.33,37.64 31.09,37.64 32.16,36.58 32.16,36.12 33.38,34.9 v36.88,34.9
  Bottom 0.152: v26.67,41.45 26.98,41.15 26.98,40.54 26.82,40.39 26.21,40.39 IC2.50 | v36.88,34.9 36.88,35.2 36.73,35.36 36.73,35.97 37.64,36.88 JP1.8
JTDO  (via drill 0.3)
  Top 0.152: v28.96,37.34 31.55,39.93 32.92,39.93 34.59,38.25 37.64,38.25 JP1.6
  Bottom 0.152: v28.96,37.34 27.43,37.34 26.98,37.8 26.21,37.8 IC2.55
JTMS
  Bottom 0.152: IC2.46 23.01,42.98 23.01,43.74 23.16,43.89 26.67,43.89 28.04,45.26 30.48,45.26 32.31,43.43 35.2,43.43 37.8,40.84 JP1.2
MAIN_OUT
  Bottom 0.152: IC6.12 17.68,48.62 17.68,47.7 17.07,47.09 14.02,47.09 C32.+
MUX_ADDR_0
  Bottom 0.152: IC4.11 34.29,40.54 33.38,39.62 33.22,39.62 32.31,38.71 32.31,37.03 31.85,36.58 31.85,36.12 31.09,35.36 27.28,35.36 26.82,35.81 26.21,35.81 IC2.59
MUX_ADDR_1  (via drill 0.3)
  Top 0.152: v34.44,39.93 33.83,39.93 33.22,40.54 29.87,40.54 25.6,36.27 v24.99,36.27
  Bottom 0.152: v34.44,39.93 34.9,40.39 34.9,40.84 IC4.10 | v24.99,36.27 26.06,36.27 IC2.58
MUX_ADDR_2  (via drill 0.3)
  Top 0.152: v31.55,35.05 30.79,35.05 29.72,33.98 29.41,33.98 v27.43,35.97
  Bottom 0.152: v31.55,35.05 33.22,35.05 34.59,36.42 34.59,39.32 35.51,40.23 35.51,40.84 IC4.9 | v27.43,35.97 26.98,36.42 26.98,36.58 26.82,36.73 26.21,36.73 IC2.57
MUXED_POTS  (via drill 0.3)
  Top 0.152: v31.55,45.41 28.19,45.41 23.01,40.23 v23.01,38.41
  Bottom 0.152: v31.55,45.41 32.31,46.18 32.31,46.48 IC4.3 | v23.01,38.41 23.62,37.8 23.62,36.58 19.96,32.92 19.96,31.24 IC2.9
N$1
  Bottom 0.152: R19.1 16.76,17.68 14.78,17.68 13.72,16.61 8.53,16.61 6.71,14.78 3.96,14.78 1.37,17.37 1.37,29.87 1.83,30.33 J1.P$1
N$2
  Bottom 0.152: 16.92,19.51 16.92,20.73 C26.1 16.76,20.73 13.41,20.73 IC5.2 | R18.1 19.36,20.73 19.36,19.51 R20.2 19.2,19.51 16.92,19.51 | 16.92,19.51 R19.2
N$3  (via drill 0.3)
  Top 0.152: v6.86,15.7 5.33,14.17 4.57,14.17 1.98,11.58 1.98,3.66 4.12,1.52 5.33,1.52 J7.P$1
  Bottom 0.152: v6.86,15.7 6.86,17.22 5.18,18.9 5.18,19.2 R14.1
N$6
  Bottom 0.152: R21.2 27.58,28.35 24.84,28.35 20.12,23.62 20.12,21.95 19.81,21.64 14.94,21.64 14.63,21.34 10.82,21.34 7.77,24.38 5.49,24.38 J3.P$1
N$7
  Bottom 0.152: IC2.6 21.34,31.09 21.34,29.87 19.51,28.04 19.51,27.74 Q1.X1
N$8
  Bottom 0.152: IC2.5 21.95,31.09 21.95,27.74 Q1.X2
N$9  (via drill 0.3)
  Top 0.152: v12.65,22.86 17.68,22.86 21.64,18.9 21.64,16.46 23.62,14.48 25.91,14.48 27.74,16.31 27.74,16.46 27.89,16.61 27.89,18.9 33.38,24.38 34.59,24.38 J6.P$1
  Bottom 0.152: v12.65,22.86 10.36,22.86 8.53,24.69 6.71,24.69 4.72,26.67 4.42,26.67 R11.1
N$10
  Bottom 0.152: R22.2 21.79,17.83 22.86,17.83 23.62,18.59 27.43,18.59 28.8,19.96 30.48,19.96 33.22,22.71 33.22,24.99 34.75,26.52 36.58,26.52 38.1,28.04 38.1,30.33 J2.P$1
N$11
  Bottom 0.152: 21.79,19.51 21.79,20.73 C29.2 | 24.08,19.51 24.08,20.73 R26.2 24.23,20.88 26.98,20.88 28.5,22.4 28.5,23.01 IC7.9 | 24.08,19.51 21.79,19.51 | 21.79,19.51 R22.1 | 24.08,19.51 R24.1
N$12
  Bottom 0.152: R1.2 16.15,99.36 17.07,99.36 18.29,98.15 LED1.3
N$13  (via drill 0.3)
  Top 0.152: v20.57,41.91 15.39,47.09 v15.39,49.23 | v11.58,49.23 10.67,50.14 10.36,50.14 v8.38,48.16
  Bottom 0.152: v20.57,41.91 23.01,41.91 23.47,42.37 23.47,42.82 IC2.47 | v11.58,49.23 v15.39,49.23 | v8.38,48.16 8.38,41.15 8.08,40.84 C22.1
N$14
  Bottom 0.152: 3.81,17.68 5.03,17.68 R14.2 | 3.81,17.68 2.59,17.68 R15.2 | 3.81,21.18 5.03,21.18 R13.1 5.18,21.03 6.86,19.36 8.08,19.36 IC5.6 | 3.81,21.18 2.59,21.18 C14.1 | 3.81,21.18 3.81,17.68
N$15
  Bottom 0.152: C28.2 30.79,28.5 29.41,28.5 R21.1 29.26,28.35 29.26,26.36 R23.1 29.41,26.21 30.79,26.21 R25.2 30.94,26.21 31.09,26.06 31.09,23.16 IC7.13
N$16
  Bottom 0.152: IC1.2 4.42,98.3 5.94,98.3 7.32,96.93 9.75,96.93 13.41,100.58 13.41,100.74 17.83,105.16 20.27,105.16 R2.1 20.42,105.31 23.01,107.9 32.16,107.9 34.44,105.61 36.12,105.61 C2.+
N$17  (via drill 0.3)
  Top 0.152: v18.75,53.65 v20.27,53.65
  Bottom 0.152: v20.27,53.65 27.43,53.65 C35.1 | 17.22,55.17 v18.75,53.65 | 17.22,55.17 17.22,56.08 IC6.16 | 17.22,55.17 16.76,54.71 14.02,54.71 C34.+
N$18
  Bottom 0.152: R54.2 28.04,3.35 30.18,3.35 C49.1 30.33,3.5 32.46,3.5 R51.2 32.61,3.35 33.38,2.59 37.64,2.59 C40.-
N$19
  Bottom 0.152: IC2.31 14.17,40.39 10.67,40.39 10.36,40.69 C16.1
N$20
  Bottom 0.152: R52.2 34.44,5.33 33.53,6.25 33.53,14.78 34.59,15.85 J6.P$2
N$21  (via drill 0.3)
  Top 0.152: v20.12,1.98 15.85,1.98 15.39,1.52 J8.P$1
  Bottom 0.152: v20.12,1.98 20.73,2.59 25.3,2.59 26.06,1.83 27.89,1.83 R54.1
N$22
  Bottom 0.152: R3.2 24.38,99.36 23.62,99.36 22.4,98.15 LED1.1
N$23  (via drill 0.3)
  Top 0.152: v1.37,1.98 1.37,28.19 v2.29,29.11 | v5.79,39.62 5.79,39.93 9.3,43.43 9.3,48.31 v10.52,49.53
  Bottom 0.152: R38.2 3.81,3.05 1.37,3.05 R43.1 1.37,2.9 v1.37,1.98 | v2.29,29.11 3.05,29.87 3.05,36.88 v5.79,39.62 | v10.52,49.53 10.52,49.99 11.28,50.75 C33.-
N$24
  Bottom 0.152: L1.1 16.46,73 14.94,73 14.48,72.54 D1.A
N$25
  Bottom 0.152: R43.2 1.22,4.72 1.22,6.55 C43.1 1.37,6.55 3.81,6.55 | 3.81,6.55 6.25,6.55 R42.1 6.4,6.55 7.47,5.49 8.99,5.49 IC8.6 | 3.81,6.55 R44.2
N$26  (via drill 0.3)
  Top 0.152: v35.36,25.6 27.58,25.6 26.52,26.67 20.27,26.67 v19.81,26.21 | v17.53,25.91 16.76,25.91 15.39,24.54 J4.P$1
  Bottom 0.152: v35.36,25.6 37.34,25.6 37.64,25.3 37.64,21.49 38.41,20.73 38.41,20.42 R34.1 | v19.81,26.21 19.36,26.21 18.59,25.45 17.98,25.45 v17.53,25.91
N$27
  Bottom 0.152: R4.2 16.15,67.97 17.37,67.97 18.29,67.06 LED2.3
N$28
  Bottom 0.152: R42.2 6.25,8.38 5.49,8.38 4.72,9.14 3.2,9.14 2.44,8.38 1.37,8.38 C43.2 1.22,8.23 1.22,7.92 0.46,7.16 0.46,3.96 0.61,3.81 7.47,3.81 9.14,2.13 R56.1 9.3,2.13 9.3,2.44 10.82,3.96 10.82,5.94 10.21,6.55 9.14,6.55 IC8.7
N$29  (via drill 0.3)
  Top 0.152: v8.38,1.07 13.26,1.07 14.78,2.59 33.53,2.59 34.59,1.52 J10.P$1
  Bottom 0.152: v8.38,1.07 8.38,1.22 7.62,1.98 R56.2
N$30
  Bottom 0.152: 36.88,18.29 36.88,20.27 R34.2 36.88,20.42 36.88,22.4 R31.1 36.88,22.55 36.88,24.69 C36.1 | 36.88,18.29 36.88,18.14 R36.2 36.88,18.29 | 36.88,18.29 31.55,18.29 31.24,17.98 31.24,17.37 IC7.2
N$31  (via drill 0.3)
  Top 0.152: v21.03,3.5 2.59,3.5 v2.59,11.43 | v2.59,13.41 2.59,23.16 3.96,24.54 3.96,33.22 6.25,35.51 7.16,35.51 8.08,36.42 8.08,36.88 13.26,42.06 13.26,45.11 v12.65,45.72
  Bottom 0.152: R33.2 22.25,7.32 22.55,7.01 R40.1 22.55,5.33 22.55,5.03 v21.03,3.5 | v2.59,13.41 v2.59,11.43 | v12.65,45.72 11.43,46.94 C32.-
N$32
  Bottom 0.152: 19.96,5.49 20.73,5.49 R40.2 | 19.96,5.49 19.36,5.49 R39.2 | 19.96,5.49 19.96,7.32 R41.1 19.81,7.47 17.83,7.47 C42.1 17.68,7.32 17.07,6.71 14.33,6.71 IC8.2
N$33
  Bottom 0.152: R55.1 19.2,1.98 19.2,2.44 21.64,4.88 21.64,6.4 20.73,7.32 20.73,8.23 19.96,8.99 R41.2 19.81,9.14 17.83,9.14 C42.2 17.68,8.99 16.61,7.92 14.33,7.92 IC8.1
N$34
  Bottom 0.152: R55.2 17.53,1.83 17.83,1.83 18.59,1.07 24.54,1.07 24.84,1.37 J9.P$1
N$35
  Bottom 0.152: R5.2 24.38,67.97 23.32,67.97 22.4,67.06 LED2.1
N$36
  Bottom 0.152: L2.1 23.77,73.61 24.99,73.61 25.91,72.69 D2.C
N$37  (via drill 0.3)
  Top 0.152: v36.12,73.91 36.12,73.61 34.75,72.24 34.75,56.69 36.27,55.17 36.27,54.56 37.8,53.03 37.8,47.7 v36.27,46.18 | v33.07,45.26 29.57,41.76 27.13,41.76 26.82,42.06 v25.6,42.06
  Bottom 0.152: v36.12,73.91 36.88,74.68 36.88,84.73 34.75,86.87 34.75,94.79 31.85,97.69 24.54,97.69 R3.1 | v36.27,46.18 35.36,45.26 v33.07,45.26 | v25.6,42.06 23.62,40.08 23.62,39.78 24.08,39.32 26.06,39.32 IC2.52
N$39  (via drill 0.3)
  Top 0.152: v17.37,12.04 v20.27,12.04
  Bottom 0.152: v20.27,12.04 20.88,11.43 25.15,11.43 26.82,9.75 29.11,9.75 R53.2 | v17.37,12.04 15.39,10.06 J8.P$2
N$40  (via drill 0.3)
  Top 0.152: v10.52,16 10.52,16.31 11.12,16.92 11.12,22.1 v17.53,28.5
  Bottom 0.152: v10.52,16 8.99,14.48 3.81,14.48 0.76,17.53 0.76,35.05 4.12,38.41 4.12,44.2 3.05,45.26 3.05,53.49 14.48,64.92 14.63,64.92 16,66.29 R4.1 | v17.53,28.5 18.44,28.5 20.42,30.48 20.42,31.09 IC2.8
N$41
  Bottom 0.152: IC6.25 23.01,56.24 23.01,58.37 24.38,59.74 24.38,60.96 Q3.X1
N$42  (via drill 0.3)
  Top 0.152: v23.77,57.76 24.38,57.76 v26.06,59.44
  Bottom 0.152: v23.77,57.76 23.62,57.61 23.62,56.24 IC6.26 | v26.06,59.44 26.06,60.35 26.67,60.96 Q3.X2
N$43  (via drill 0.3)
  Top 0.152: v16.31,76.96 16.31,76.66 15.85,76.2 15.85,66.6 21.03,61.42 v23.47,61.42 | v22.1,57.91 18.14,53.95 18.14,47.24 20.73,44.65 21.18,44.65 21.64,44.2 21.64,40.39 v21.49,40.23
  Bottom 0.152: v16.31,76.96 16.31,82.75 16.15,82.91 16.15,97.69 R1.1 | v23.47,61.42 23.47,59.28 v22.1,57.91 | v21.49,40.23 22.71,40.23 24.08,38.86 26.06,38.86 IC2.53
N$44  (via drill 0.3)
  Top 0.152: v30.33,60.5 30.33,59.13 31.24,58.22 31.24,55.63 34.59,52.27 v34.9,52.27 | v33.68,47.85 33.68,45.11 31.7,43.13 31.39,43.13 28.5,40.23 v24.99,40.23
  Bottom 0.152: v30.33,60.5 24.54,66.29 R5.1 | v34.9,52.27 34.9,51.66 34.59,51.36 34.59,48.77 v33.68,47.85 | v24.99,40.23 25.3,39.93 26.06,39.93 IC2.51
N$45  (via drill 0.3)
  Top 0.152: v18.9,4.12 21.49,4.12 22.1,3.5 27.74,3.5 31.7,7.47 31.7,9.3 32.31,9.91 34.59,9.91 J10.P$2
  Bottom 0.152: v18.9,4.12 17.68,5.33 R39.1
N$46
  Bottom 0.152: R44.1 3.81,8.23 4.88,8.23 5.64,7.47 7.01,7.47 7.62,8.08 7.62,10.21 9.91,12.5 SJ1.1
N$47
  Bottom 0.152: SJ1.2 10.82,12.65 13.41,12.65 14.94,14.17 17.37,14.17 21.49,10.06 24.84,10.06 J9.P$2
N$48
  Bottom 0.152: R35.1 26.98,11.73 26.98,12.19 26.06,13.11 26.06,13.41 24.69,14.78 23.16,14.78 20.88,17.07 20.88,23.16 22.1,24.38 24.84,24.38 J5.P$1
N$49
  Bottom 0.152: C38.1 32.31,11.73 32.31,13.87 R32.1 32.16,14.02 31.39,14.78 28.65,14.78 | R35.2 28.8,11.73 28.8,13.87 R37.2 28.8,14.02 28.65,14.17 28.65,14.78 | 28.65,14.78 28.65,17.22 IC7.6
N$53  (via drill 0.3)
  Top 0.152: v13.87,24.08 14.63,23.32 15.7,23.32 v18.44,26.06 | v18.75,27.28 24.38,27.28 24.69,26.98 26.21,26.98 29.57,30.33 J2.P$2
  Bottom 0.152: v13.87,24.08 13.87,26.52 12.8,27.58 11.58,27.58 10.67,26.67 R50.2 | v18.44,26.06 18.44,26.98 v18.75,27.28
N$56
  Top 0.152: JP3.1 15.09,82.14 15.09,79.7 JP3.2
  Bottom 0.152: L1.2 17.98,73.15 16.76,74.37 16.61,74.37 15.39,75.59 15.39,79.4 15.24,79.55 JP3.2
N$64
  Top 0.152: JP3.9 25.3,82.14 25.3,79.7 JP3.10
  Bottom 0.152: L2.2 22.25,73.76 22.25,76.66 25.15,79.55 JP3.10
N$66
  Bottom 0.152: R11.2 6.1,26.82 6.1,28.96 6.25,29.11 Q2.B
NORMALIZATION_PROBE  (via drill 0.3)
  Top 0.152: v16.92,38.25 14.94,36.27 14.94,27.43 10.36,22.86 10.36,16.61 9.91,16.15 9.91,15.85 14.33,11.43 25.76,11.43 28.19,8.99 v28.19,8.38
  Bottom 0.152: 35.36,7.01 36.42,7.01 37.8,8.38 D3.3 | 35.36,7.01 34.59,7.01 R52.1 | v16.92,38.25 19.36,40.69 19.36,42.82 IC2.39 | v28.19,8.38 28.8,8.38 29.11,8.08 R53.1 29.26,8.08 31.7,8.08 R57.1 31.85,7.92 31.85,6.4 33.83,4.42 35.2,4.42 35.36,4.57 35.36,7.01
POSITION_ATT  (via drill 0.3)
  Top 0.152: v31.55,42.52 34.29,45.26 34.29,51.51 30.79,55.02 28.35,55.02 v27.13,56.24 | v25.6,56.24 24.54,56.24 22.1,58.67 22.1,59.28 21.64,59.74 16.15,59.74 7.77,51.36 7.77,42.37 3.05,37.64 3.05,36.12 3.66,35.51 5.64,35.51 6.55,36.42 R49.P$2
  Bottom 0.152: v31.55,42.52 31.55,41 IC4.15 | v25.6,56.24 v27.13,56.24
POSITION_CV  (via drill 0.3)
  Top 0.152: v15.7,36.27 15.7,32.31 18.14,29.87 18.14,27.13 21.95,23.32 21.95,16.61 23.77,14.78 25.45,14.78 v26.98,16.31
  Bottom 0.152: R32.2 30.63,13.87 30.63,11.73 C38.2 30.48,11.58 30.02,11.58 29.26,10.82 28.19,10.82 27.89,11.12 27.89,12.34 27.13,13.11 26.52,13.11 26.36,13.26 26.36,15.7 v26.98,16.31 IC7.7 | v15.7,36.27 14.33,36.27 IC2.23
POSITION_POT  (via drill 0.3)
  Top 0.152: v31.7,38.56 31.7,38.1 33.22,36.58 R30.P$2
  Bottom 0.152: v31.7,38.56 33.53,40.39 33.53,40.84 IC4.12
RESET  (via drill 0.3)
  Top 0.152: v33.07,37.8 33.38,37.8 34.75,36.42 34.75,36.12 35.36,35.51 37.49,35.51 | 37.49,35.51 37.64,35.51 JP1.10 37.49,35.51 | v26.67,32 28.5,32 30.79,34.29 37.03,34.29 37.49,34.75 37.49,35.51
  Bottom 0.152: v33.07,37.8 33.68,38.41 33.68,38.71 R60.1 | v26.67,32 21.18,32 21.03,31.85 21.03,31.24 IC2.7
STRUM  (via drill 0.3)
  Top 0.152: v10.97,29.11 10.67,29.11 v10.06,28.5
  Bottom 0.152: R8.1 5.33,33.98 5.33,31.39 Q2.C 5.33,31.24 5.79,31.24 8.53,28.5 v10.06,28.5 | v10.97,29.11 13.72,29.11 15.7,31.09 16.31,31.09 IC2.16
SW_MODE  (via drill 0.3)
  Top 0.152: v24.99,37.03 25.91,37.03 30.79,41.91 32.46,41.91 32.92,42.37 32.92,42.98 35.66,45.72 35.66,47.7 37.19,49.23 37.19,52.73 32.46,57.45 32.46,59.74 30.48,61.72 23.93,61.72 22.55,63.09 19.81,63.09 17.07,65.84 SW2.3
  Bottom 0.152: v24.99,37.03 22.86,34.9 22.86,33.98 23.32,33.53 23.62,33.53 24.08,33.98 24.08,34.14 24.84,34.9 26.06,34.9 IC2.61 | SW2.4 23.47,71.17 17.07,71.17 SW2.3
SW_POLYPHONY  (via drill 0.3)
  Top 0.152: v24.99,34.29 24.99,34.59 23.32,36.27 23.32,37.34 v23.01,37.64 | v18.29,37.64 13.87,42.06 13.87,49.99 v10.52,53.34 | v8.08,55.78 8.08,95.1 15.09,102.11 17.07,102.11 SW1.3
  Bottom 0.152: v24.99,34.29 26.06,34.29 IC2.62 | v18.29,37.64 v23.01,37.64 | v8.08,55.78 v10.52,53.34 | SW1.4 23.47,102.26 22.55,102.26 21.34,103.48 18.29,103.48 17.07,102.26 SW1.3
V_OCT_CV  (via drill 0.3)
  Top 0.152: v14.33,27.58 14.33,27.28 9.75,22.71 v9.75,21.64
  Bottom 0.152: C14.2 2.59,22.86 5.03,22.86 R13.2 5.18,22.71 5.49,22.71 7.47,20.73 8.08,20.73 IC5.7 8.23,20.73 8.84,20.73 v9.75,21.64 | v14.33,27.58 16.92,30.18 16.92,31.09 IC2.15
VCC  (via drill 0.3)
  Top 0.152: v6.86,10.21 v8.38,10.21
  Bottom 0.152: IC8.8 9.14,7.92 9.91,8.69 9.91,10.06 C39.1 9.91,10.21 v8.38,10.21 | R2.2 20.27,102.26 18.9,102.26 16.92,100.28 15.39,100.28 10.52,95.4 10.52,91.29 9.6,90.37 C3.+ 9.45,90.22 9.3,90.07 9.3,83.67 14.33,78.64 14.33,76.35 D1.C 14.33,76.2 12.04,76.2 0.46,64.62 0.46,16.31 5.03,11.73 5.33,11.73 v6.86,10.21
VEE  (via drill 0.3)
  Top 0.152: v33.38,82.6 33.38,81.84 31.85,80.31 31.85,79.7 v30.63,78.49 | v2.74,2.13 2.74,2.44 1.68,3.5 1.68,22.71 3.66,24.69 3.66,35.05 2.74,35.97 2.74,39.78 5.64,42.67 5.64,58.22 7.47,60.05 v7.47,61.57
  Bottom 0.152: IC8.4 14.17,3.96 12.8,2.59 12.8,2.13 C45.2 12.65,1.98 11.12,0.46 7.62,0.46 6.55,1.52 6.55,1.98 5.94,2.59 4.88,2.59 4.42,2.13 v2.74,2.13 | v33.38,82.6 34.9,84.12 C1.- | v30.63,78.49 29.72,77.57 R12.2 29.57,77.42 26.98,77.42 26.06,76.5 D2.A 26.06,76.35 24.08,74.37 23.32,74.37 23.01,74.07 23.01,73.15 23.16,73 23.47,73 24.84,71.63 24.84,70.71 24.08,69.95 16.15,69.95 7.77,61.57 v7.47,61.57

## Text on the board
bNames: Gillet | by Olivier | Mod by | Codex Modulex | Original design | µRinks | Q3 | CC-BY-SA 3.0 | 2019 - v4.0 | Q1